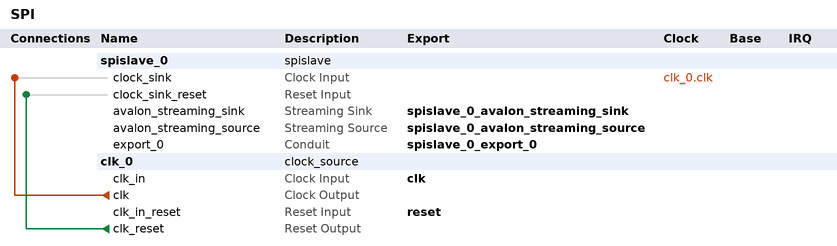
[diagram p0: system contents]
# Platform Designer (Qsys) system SPI, Cyclone IV E EP4CE10F17C8
# Parameters at their usual value, and those the tool derives, are not listed.
package require -exact qsys 18.0
create_system SPI
set_project_property DEVICE_FAMILY {Cyclone IV E}
set_project_property DEVICE EP4CE10F17C8

add_instance spislave_0 spislave 18.0
set_instance_property spislave_0 AUTO_EXPORT true
set_instance_parameter_value spislave_0 SYNC_DEPTH 2

add_instance clk_0 clock_source 18.0
set_instance_parameter_value clk_0 clockFrequency 50000000

# connections
add_connection clk_0.clk spislave_0.clock_sink clock
add_connection clk_0.clk_reset spislave_0.clock_sink_reset reset

# exported interfaces
add_interface clk clock sink
set_interface_property clk EXPORT_OF clk_0.clk_in
add_interface reset reset sink
set_interface_property reset EXPORT_OF clk_0.clk_in_reset
add_interface spislave_0_avalon_streaming_sink avalon_streaming sink
set_interface_property spislave_0_avalon_streaming_sink EXPORT_OF spislave_0.avalon_streaming_sink
add_interface spislave_0_avalon_streaming_source avalon_streaming source
set_interface_property spislave_0_avalon_streaming_source EXPORT_OF spislave_0.avalon_streaming_source
add_interface spislave_0_export_0 conduit end
set_interface_property spislave_0_export_0 EXPORT_OF spislave_0.export_0

set_interconnect_requirement {$system} qsys_mm.clockCrossingAdapter HANDSHAKE
set_interconnect_requirement {$system} qsys_mm.enableEccProtection FALSE
set_interconnect_requirement {$system} qsys_mm.insertDefaultSlave FALSE
set_interconnect_requirement {$system} qsys_mm.maxAdditionalLatency 1

save_system SPI.qsys
